# Altium schematic sheet Power and connectors.SchDoc: Power and Connectors
size A4; Author: r.rodriguezz; Organization: B105 Laboratory; Address1: Integrated Systems Laboratory; Address2: ETSIT - UPM; Address3: Avda Complutense, 30; Address4: 28040 Madrid Spain
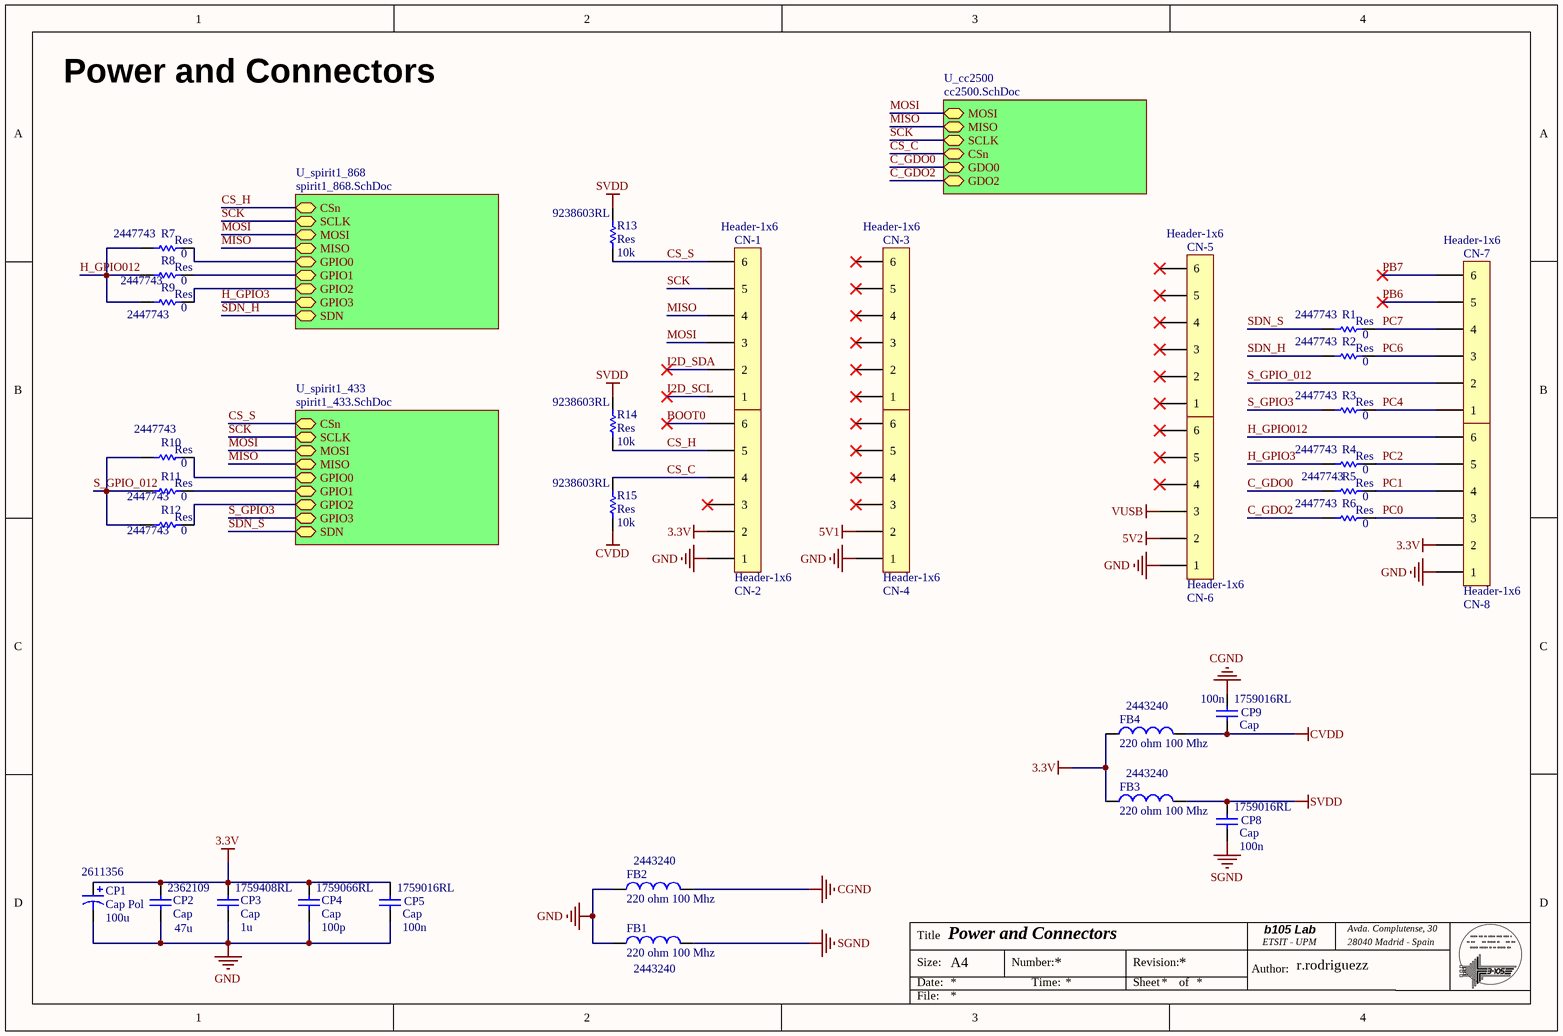
[diagram p0: Power and connectors.SchDoc]

## Parts
CN-1  Header-1x6  [Header-1x6]
CN-2  Header-1x6  [Header-1x6]
CN-3  Header-1x6  [Header-1x6]
CN-4  Header-1x6  [Header-1x6]
CN-5  Header-1x6  [Header-1x6]
CN-6  Header-1x6  [Header-1x6]
CN-7  Header-1x6  [Header-1x6]
CN-8  Header-1x6  [Header-1x6]
CP1  Cap Pol  value 100u  Supplier Part Number 1: 2611356  [CAP POL SMD_6.3MM]
CP2  Cap  value 47u  Supplier Part Number 1: 2362109  [0805 CAP]
CP3  Cap  value 1u  Supplier Part Number 1: 1759408RL  [0603 Cap]
CP4  Cap  value 100p  Supplier Part Number 1: 1759066RL  [0603 Cap]
CP5  Cap  value 100n  Supplier Part Number 1: 1759016RL  [0603 Cap]
CP8  Cap  value 100n  Supplier Part Number 1: 1759016RL  [0603 Cap]
CP9  Cap  value 100n  Supplier Part Number 1: 1759016RL  [0603 Cap]
FB1  Supplier Part Number 1: 2443240  [0603 Ferrite]  (hidden comment: 220 ohm 100 Mhz)
FB2  Supplier Part Number 1: 2443240  [0603 Ferrite]  (hidden comment: 220 ohm 100 Mhz)
FB3  Supplier Part Number 1: 2443240  [0603 Ferrite]  (hidden comment: 220 ohm 100 Mhz)
FB4  Supplier Part Number 1: 2443240  [0603 Ferrite]  (hidden comment: 220 ohm 100 Mhz)
R1  Res  value 0  Supplier Part Number 1: 2447743  [0603 Res]
R2  Res  value 0  Supplier Part Number 1: 2447743  [0603 Res]
R3  Res  value 0  Supplier Part Number 1: 2447743  [0603 Res]
R4  Res  value 0  Supplier Part Number 1: 2447743  [0603 Res]
R5  Res  value 0  Supplier Part Number 1: 2447743  [0603 Res]
R6  Res  value 0  Supplier Part Number 1: 2447743  [0603 Res]
R7  Res  value 0  Supplier Part Number 1: 2447743  [0603 Res]
R8  Res  value 0  Supplier Part Number 1: 2447743  [0603 Res]
R9  Res  value 0  Supplier Part Number 1: 2447743  [0603 Res]
R10  Res  value 0  Supplier Part Number 1: 2447743  [0603 Res]
R11  Res  value 0  Supplier Part Number 1: 2447743  [0603 Res]
R12  Res  value 0  Supplier Part Number 1: 2447743  [0603 Res]
R13  Res  value 10k  Supplier Part Number 1: 9238603RL  [0603 Res]
R14  Res  value 10k  Supplier Part Number 1: 9238603RL  [0603 Res]
R15  Res  value 10k  Supplier Part Number 1: 9238603RL  [0603 Res]

## Sub-sheets
U_cc2500 = cc2500.SchDoc: MOSI (bidir), MISO (bidir), SCLK (bidir), CSn (bidir), GDO0 (bidir), GDO2 (bidir)
U_spirit1_433 = spirit1_433.SchDoc: CSn (bidir), SCLK (bidir), MOSI (bidir), MISO (bidir), GPIO0 (bidir), GPIO1 (bidir), GPIO2 (bidir), GPIO3 (bidir), SDN (bidir)
U_spirit1_868 = spirit1_868.SchDoc: CSn (bidir), SCLK (bidir), MOSI (bidir), MISO (bidir), GPIO0 (bidir), GPIO1 (bidir), GPIO2 (bidir), GPIO3 (bidir), SDN (bidir)

## Nets
3.3V: CN-2.2 CN-8.2 CP1.1 CP2.2 CP3.2 CP4.2 CP5.2 FB3.1 FB4.1
5V1: CN-4.2
5V2: CN-6.2
CGND: CP9.2 FB2.2
CVDD: CP9.1 FB4.2 R15.1
GND: CN-2.1 CN-4.1 CN-6.1 CN-8.1 CP1.2 CP2.1 CP3.1 CP4.1 CP5.1 FB1.1 FB2.1
SGND: CP8.1 FB1.2
SVDD: CP8.2 FB3.2 R13.2 R14.2
VUSB: CN-6.3
BOOT0: CN-2.6
C_GDO0: R5.1 ; sheet U_cc2500/GDO0
C_GDO2: R6.1 ; sheet U_cc2500/GDO2
CS_C: CN-2.4 R15.2 ; sheet U_cc2500/CSn
CS_H: CN-2.5 R14.1 ; sheet U_spirit1_868/CSn
CS_S: CN-1.6 R13.1 ; sheet U_spirit1_433/CSn
H_GPIO3: R4.1 ; sheet U_spirit1_868/GPIO3
H_GPIO012: CN-8.6 R7.1 R8.1 R9.1
I2D_SCL: CN-1.1
I2D_SDA: CN-1.2
MISO: CN-1.4 ; sheet U_cc2500/MISO, sheet U_spirit1_433/MISO, sheet U_spirit1_868/MISO
MOSI: CN-1.3 ; sheet U_cc2500/MOSI, sheet U_spirit1_433/MOSI, sheet U_spirit1_868/MOSI
PB6: CN-7.5
PB7: CN-7.6
PC0: CN-8.3 R6.2
PC1: CN-8.4 R5.2
PC2: CN-8.5 R4.2
PC4: CN-7.1 R3.2
PC6: CN-7.3 R2.2
PC7: CN-7.4 R1.2
S_GPIO3: R3.1 ; sheet U_spirit1_433/GPIO3
S_GPIO_012: CN-7.2 R10.1 R11.1 R12.1
SCK: CN-1.5 ; sheet U_cc2500/SCLK, sheet U_spirit1_433/SCLK, sheet U_spirit1_868/SCLK
SDN_H: R2.1 ; sheet U_spirit1_868/SDN
SDN_S: R1.1 ; sheet U_spirit1_433/SDN
NetR7_2: R7.2 ; sheet U_spirit1_868/GPIO0
NetR8_2: R8.2 ; sheet U_spirit1_868/GPIO1
NetR9_2: R9.2 ; sheet U_spirit1_868/GPIO2
NetR10_2: R10.2 ; sheet U_spirit1_433/GPIO0
NetR11_2: R11.2 ; sheet U_spirit1_433/GPIO1
NetR12_2: R12.2 ; sheet U_spirit1_433/GPIO2

Not connected (* = marked no-connect by the designer): CN-2 3*; CN-3 1* 2* 3* 4* 5* 6*; CN-4 3* 4* 5* 6*; CN-5 1* 2* 3* 4* 5* 6*; CN-6 4* 5* 6*

## Notes on the sheet
- Title
- Size:
- Date:
- A4
- Number:
- Time:
- Revision:
- Sheet
- of
- Author:
- ETSIT - UPM
- b105 Lab
- Avda. Complutense, 30
- 28040 Madrid - Spain
- File:

## Library data of the parts
CP1 = Cap Pol: Manufacturer: MULTICOMP; Manufacturer Part Number: MCVVT016M101EA1L; AE Capacitor Case: Radial Can - SMD; Capacitance: 100; Voltage Rating: 16; Product Range: VT, V-Chip Series; Lifetime @ Temperature: 2000 hours @ 105; Ripple Current AC: 6.3; SVHC: No SVHC (17-Dec-2015; Description 1: MULTICOMP - MCVVT016M101EA1L - CAP, ALU ELEC, 100UF, 16V, RAD CAN SMD; Supplier 1: Farnell; RoHS: YES; Stock 1: 874; Pricing 1: 5=0.103, 40=0.0679, 90=0.061, 250=0.0524, 500=0.0446 (GBP); ESR: -; Packaging: Cut Tape; Operating Temperature Min: -55; Operating Temperature Max: 105; Diameter: 6.3; Height: 5.4; Automotive Qualification Standard: -; ComponentLink1URL: http://www.farnell.com/datasheets/2151198.pdf; ComponentLink1Description: http://www.farnell.com/datasheets/2151198.pdf
CP2 = Cap: Manufacturer: MURATA; Manufacturer Part Number: GRM21BR60J476ME15L; Ceramic Capacitor Case: 0805 [2012 Metric]; Capacitance: 47; Voltage Rating: 6.3; Capacitance Tolerance: ± 20%; Dielectric Characteristic: X5; Product Range: GRM Series; SVHC: No SVHC (17-Dec-2015); Capacitance Tolerance ±: ± 20%<!--FANDB--><div class="features-and-benefits-container"><div class="features-and-benefits-description"><span class="features-benefits-value">The Murata GRM series capacitors are Multilayer Ceramic Chip Capacitors (MLCC) used for general purpose applications. These MLCC capacitors are classified into temperature compensating and high dielectric constant types depending on the change in electrostatic capacitance due to change in temperature. The temperature compensating capacitors feature a small rate of change in electrostatic capacitance as the temperature changes and are used for applications such as filters and high frequency circuit matching. The high dielectric constant capacitors use materials with a high dielectric constant and feature a large electrostatic capacitance. Typical applications are power supply decoupling and smoothing circuits.</span></div><div class="features-and-benefits-list"><ul class="features-and-benefits-list-list"><li class="features-and-benefits-list-item">Large capacity and small size in a multilayer structure</li><li class="features-and-benefits-list-item">Capacitance value ranging from 0.1pF to 220?F</li><li class="features-and-benefits-list-item">Tin plated external electrodes, excellent solderability</li><li class="features-and-benefits-list-item">Provides good high frequency characteristics</li><li class="features-and-benefits-list-item">Excellent pulse response</li><li class="features-and-benefits-list-item">High reliability</li><li class="features-and-benefits-list-item">Capacitor size varies from 0.4×0.2mm to 5.7×5.0mm</li><li class="features-and-benefits-list-item">Rated voltage of 2.5VDC to 3.15; Description 1: MURATA - GRM21BR60J476ME15L - CAP, MLCC, X5R, 47UF, 6.3V, 0805; Supplier 1: Farnell; RoHS: YES; Stock 1: 14015; Pricing 1: 5=0.231, 50=0.154, 250=0.126, 500=0.116, 1500=0.099, 3000=0.0957, 15000=0.0924, 30000=0.0906 (GBP); Packaging: Cut Tape; Operating Temperature Min: -55; Operating Temperature Max: 85; Automotive Qualification Standard: -; MSL: MSL 1 - Unlimited; ComponentLink1URL: http://www.farnell.com/datasheets/2047835.pdf; ComponentLink1Description: http://www.farnell.com/datasheets/2047835.pdf; ComponentLink2URL: http://www.farnell.com/datasheets/2006461.pdf; ComponentLink2Description: http://www.farnell.com/datasheets/2006461.pdf
CP3 = Cap: Manufacturer: MULTICOMP; Manufacturer Part Number: MC0603F105Z160CT; Description 1: MULTICOMP - MC0603F105Z160CT - CAP, MLCC, Y5V, 1UF, 0603; Ceramic Capacitor Case: 0603 [1608 Metric]; Capacitance: 1; Voltage Rating: 16; Capacitance Tolerance: +80%, -20%; Dielectric Characteristic: Y5; Product Range: MC Series; SVHC: No SVHC (15-Jun-2015); Capacitor Terminals: SMD; Supplier 1: Farnell; RoHS: YES; Stock 1: 184058; Pricing 1: 10=0.0114, 200=0.0084, 400=0.0074, 1000=0.0066, 2000=0.0055 (GBP); ComponentLink1URL: http://www.farnell.com/datasheets/1901289.pdf; ComponentLink1Description: http://www.farnell.com/datasheets/1901289.pdf; Packaging: Cut Tape; Operating Temperature Min: -30; Operating Temperature Max: 85; Automotive Qualification Standard: -; MSL: -; Capacitance Tolerance ±: +80%, -20%; Operating Temperature Range: -30°C to +85°C<!--FANDB--><div class="features-and-benefits-container"><div class="features-and-benefits-description"><span class="features-benefits-value">The Multicomp MC series is general purpose MLCC capacitors with Y5V dielectric material which provides high electrical precision, stability and reliability. This MLCC capacitor consists of a conducting material and electrodes with high density and high efficiency ceramic condensers.</span></div><div class="features-and-benefits-list"><ul class="features-and-benefits-list-list"><li class="features-and-benefits-list-item">Small size with higher capacitance values</li><li class="features-and-benefits-list-item">0201, 0402, 0603, 0805, 1206, 1210, 1812 case sizes available</li><li class="features-and-benefits-list-item">Capacitance value ranging from 0.01?F to 100?F</li><li class="features-and-benefits-list-item">Capacitor with lead free termination (pure Tin)</li><li class="features-and-benefits-list-item">High electrical precision, stability and reliability</li><li class="features-and-benefits-list-item">Rated voltage of 6.3V, 10V, 16V, 25V, 50V, 100V</li><li class="features-and-benefits-list-item">Operating temperature of -25°C to +85°C</li><li class="features-and-benefits-list-item">Available in ±20% and -20/+80
CP4 = Cap: Manufacturer: MULTICOMP; Manufacturer Part Number: MC0603N101J500CT; Ceramic Capacitor Case: 0603 [1608 Metric]; Capacitance: 100; Voltage Rating: 50; Capacitance Tolerance: ± 5%; Dielectric Characteristic: C0G / NP0; Product Range: MC Series; SVHC: No SVHC (17-Dec-2015); Capacitor Terminals: SMD; External Depth: 1.6; External Length / Height: 0.8; No. of Pins: 2; Temperature Coefficient: 0ppm/°C ± 30ppm/°C<!--FANDB--><div class="features-and-benefits-container"><div class="features-and-benefits-description"><span class="features-benefits-value">The Multicomp MC series is general purpose MLCC capacitors with C0G (NP0) dielectric material which provides high electrical precision, stability and reliability. This MLCC capacitor consists of a conducting material and electrodes with high density and high efficiency ceramic condensers.</span></div><div class="features-and-benefits-list"><ul class="features-and-benefits-list-list"><li class="features-and-benefits-list-item">Small size with higher capacitance values</li><li class="features-and-benefits-list-item">0201, 0402, 0603, 0805, 1206, 1210, 1812 case sizes available</li><li class="features-and-benefits-list-item">Capacitance value ranging from 0.1pF to 0.1?F</li><li class="features-and-benefits-list-item">Capacitor with lead free termination (pure Tin)</li><li class="features-and-benefits-list-item">High electrical precision, stability and reliability</li><li class="features-and-benefits-list-item">Rated voltage of 10V, 16V, 25V, 50V, 100V</li><li class="features-and-benefits-list-item">Operating temperature of -55°C to +125°C</li><li class="features-and-benefits-list-item">Temperature coefficient (TCR) of ±30; Description 1: MULTICOMP - MC0603N101J500CT - CAP, MLCC, C0G/NP0, 100PF, 50V, 0603; Supplier 1: Farnell; RoHS: YES; Stock 1: 24335; Pricing 1: 10=0.0058, 300=0.0047, 500=0.004, 1000=0.0034, 2000=0.0029 (GBP); Packaging: Cut Tape; Operating Temperature Min: -55; Operating Temperature Max: 125; Automotive Qualification Standard: -; MSL: -; Capacitance Tolerance ±: ± 5%; External Width: 0.8; Operating Temperature Range: -55°C to +125; ComponentLink1URL: http://www.farnell.com/datasheets/1901289.pdf; ComponentLink1Description: http://www.farnell.com/datasheets/1901289.pdf
CP5 CP8 CP9 = Cap: Manufacturer: MULTICOMP; Manufacturer Part Number: MC0603B104K160CT; Ceramic Capacitor Case: 0603 [1608 Metric]; Capacitance: 0.1; Voltage Rating: 16; Capacitance Tolerance: ± 10%; Dielectric Characteristic: X7; Product Range: MC Series; SVHC: No SVHC (17-Dec-2015)<!--FANDB--><div class="features-and-benefits-container"><div class="features-and-benefits-description"><span class="features-benefits-value">The Multicomp MC series is general purpose MLCC capacitors with X7R dielectric material which provides high electrical precision, stability and reliability. This MLCC capacitor consists of a conducting material and electrodes with high density and high efficiency ceramic condensers.</span></div><div class="features-and-benefits-list"><ul class="features-and-benefits-list-list"><li class="features-and-benefits-list-item">Small size with higher capacitance values</li><li class="features-and-benefits-list-item">0201, 0402, 0603, 0805, 1206, 1210, 1812 case sizes available</li><li class="features-and-benefits-list-item">Capacitance value ranging from 100pF to 47?F</li><li class="features-and-benefits-list-item">Capacitor with lead free termination (pure Tin)</li><li class="features-and-benefits-list-item">High electrical precision, stability and reliability</li><li class="features-and-benefits-list-item">Rated voltage of 6.3V, 10V, 16V, 25V, 50V, 100V</li><li class="features-and-benefits-list-item">Operating temperature of -55°C to +125°C</li><li class="features-and-benefits-list-item">Available in ±5%, ±10% and ±20; Description 1: MULTICOMP - MC0603B104K160CT - CAP, MLCC, X7R, 100NF, 16V, 0603; Supplier 1: Farnell; RoHS: YES; Stock 1: 78340; Pricing 1: 10=0.0065, 250=0.0053, 500=0.0044, 1000=0.0038, 2000=0.0033 (GBP); Packaging: Cut Tape; Operating Temperature Min: -55; Operating Temperature Max: 125; Automotive Qualification Standard: -; MSL: -; ComponentLink1URL: http://www.farnell.com/datasheets/1901289.pdf; ComponentLink1Description: http://www.farnell.com/datasheets/1901289.pdf
FB1-FB4 = Ferrita: INDUCTOR, 0.04OHM, 3A, 0805; Manufacturer: MURATA; Manufacturer Part Number: BLM18KG300TN1D; Impedance @ 100MHz: 30; Ferrite Case Style: 0603 [1608 Metric]; Product Range: BLM18; DC Current Rating: 5; DC Resistance Max: 0.01; Impedance Tolerance: ± 25%; SVHC: No SVHC (17-Dec-2015); Ferrite Mounting: SMD; Description 1: MURATA - BLM18KG300TN1D - FERRITE, BEAD, 0603, 0.01OHM, 5A; Value: 220 ohm 100 Mhz; Supplier 1: Farnell; RoHS: YES; Stock 1: 7349; Pricing 1: 10=0.0515, 100=0.0319, 500=0.0231, 1000=0.0209, 2000=0.0172, 4000=0.0143, 20000=0.012, 40000=0.0118 (GBP); Automotive Qualification Standard: -; MSL: MSL 1 - Unlimited<!--FANDB--><div class="features-and-benefits-container"></div>; ComponentLink1URL: http://www.farnell.com/datasheets/1851894.pdf; ComponentLink1Description: http://www.farnell.com/datasheets/1851894.pdf
R1-R12 = Res: Manufacturer: MULTICOMP; Manufacturer Part Number: MCWR06X000 PTL; Resistor Case Style: 0603 [1608 Metric]; Power Rating: 100; Product Range: MCWR Series; Resistor Element Material: Thick Film; Temperature Coefficient: -200ppm/°C to +400; SVHC: No SVHC (17-Dec-2015)<!--FANDB--><div class="features-and-benefits-container"><div class="features-and-benefits-description"><span class="features-benefits-value">The MCWR06X000 PTL is a thick film Chip Resistor with 0603 chip format. The resistor is constructed in a high grade ceramic body (aluminium oxide). Internal metal electrodes are added at each end and connected by a resistive paste that is applied to the top surface of the substrate. The composition of the paste is adjusted to give the approximate resistance required and the value is trimmed to within tolerance by laser cutting of this resistive layer.</span></div><div class="features-and-benefits-list"><ul class="features-and-benefits-list-list"><li class="features-and-benefits-list-item">High reliability and stability</li><li class="features-and-benefits-list-item">Reduced size of final equipment</li><li class="features-and-benefits-list-item">Lower assembly costs</li><li class="features-and-benefits-list-item">Higher component and equipment reliability</li></ul></div><div class="features-and-benefits-applications"><ul class="features-and-benefits-value"><li class="features-and-benefits-list-item">Consumer Electronics</li><li class="features-and-benefits-list-item">Computers & Computer Peripherals</li><li class="features-and-benefits-list-item">Communications & Networking</li></ul></div></div>; Description 1: MULTICOMP - MCWR06X000 PTL - RES, THICK FILM, 0 OHM, JUMPER, 0.1W; Supplier 1: Farnell; RoHS: YES; Stock 1: 83707; Pricing 1: 10=0.0027, 500=0.0016, 750=0.0012, 1250=0.0009, 2500=0.0007 (GBP); Resistance: 0; Voltage Rating: -; Resistance Tolerance: -; Packaging: Cut Tape; Automotive Qualification Standard: -; ComponentLink1URL: http://www.farnell.com/datasheets/1849611.pdf; ComponentLink1Description: http://www.farnell.com/datasheets/1849611.pdf
R13-R15 = Res: Manufacturer: YAGEO (PHYCOMP); Manufacturer Part Number: RC0603FR-0710KL; Description 1: YAGEO (PHYCOMP) - RC0603FR-0710KL - RES, THICK FILM, 10K, 1%, 0.1W, 0603; Supplier 1: Farnell; RoHS: YES; Stock 1: 229160; Pricing 1: 150=0.0069, 300=0.0059, 750=0.0052, 1250=0.0041, 2500=0.0034 (GBP); ComponentLink1URL: http://www.farnell.com/datasheets/1868787.pdf; ComponentLink1Description: http://www.farnell.com/datasheets/1868787.pdf